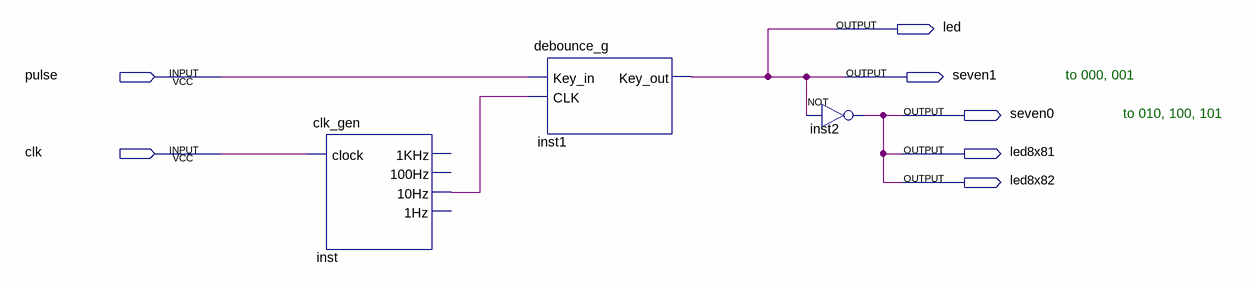
[diagram p0: schematic sheet]
// Quartus schematic pulse4.bdf as structural Verilog: 3 symbols, 7 pins
module pulse4 (
  input  pulse,
  input  clk,
  output led,
  output seven1,
  output seven0,
  output led8x81,
  output led8x82
);

  wire inst_10hz;

  clk_gen inst (.clock(clk), .\10Hz (inst_10hz));  // open: 1KHz, 100Hz, 1Hz
  debounce_g inst1 (.Key_in(pulse), .CLK(inst_10hz), .Key_out(led));
  not inst2 (led8x81, led);

  assign led8x82 = led8x81;
  assign seven0 = led8x81;
  assign seven1 = led;

  // Notes on the sheet:
  //   to 000, 001
  //   to 010, 100, 101
endmodule
